# Altium project Candunio v2018july.PrjPcb
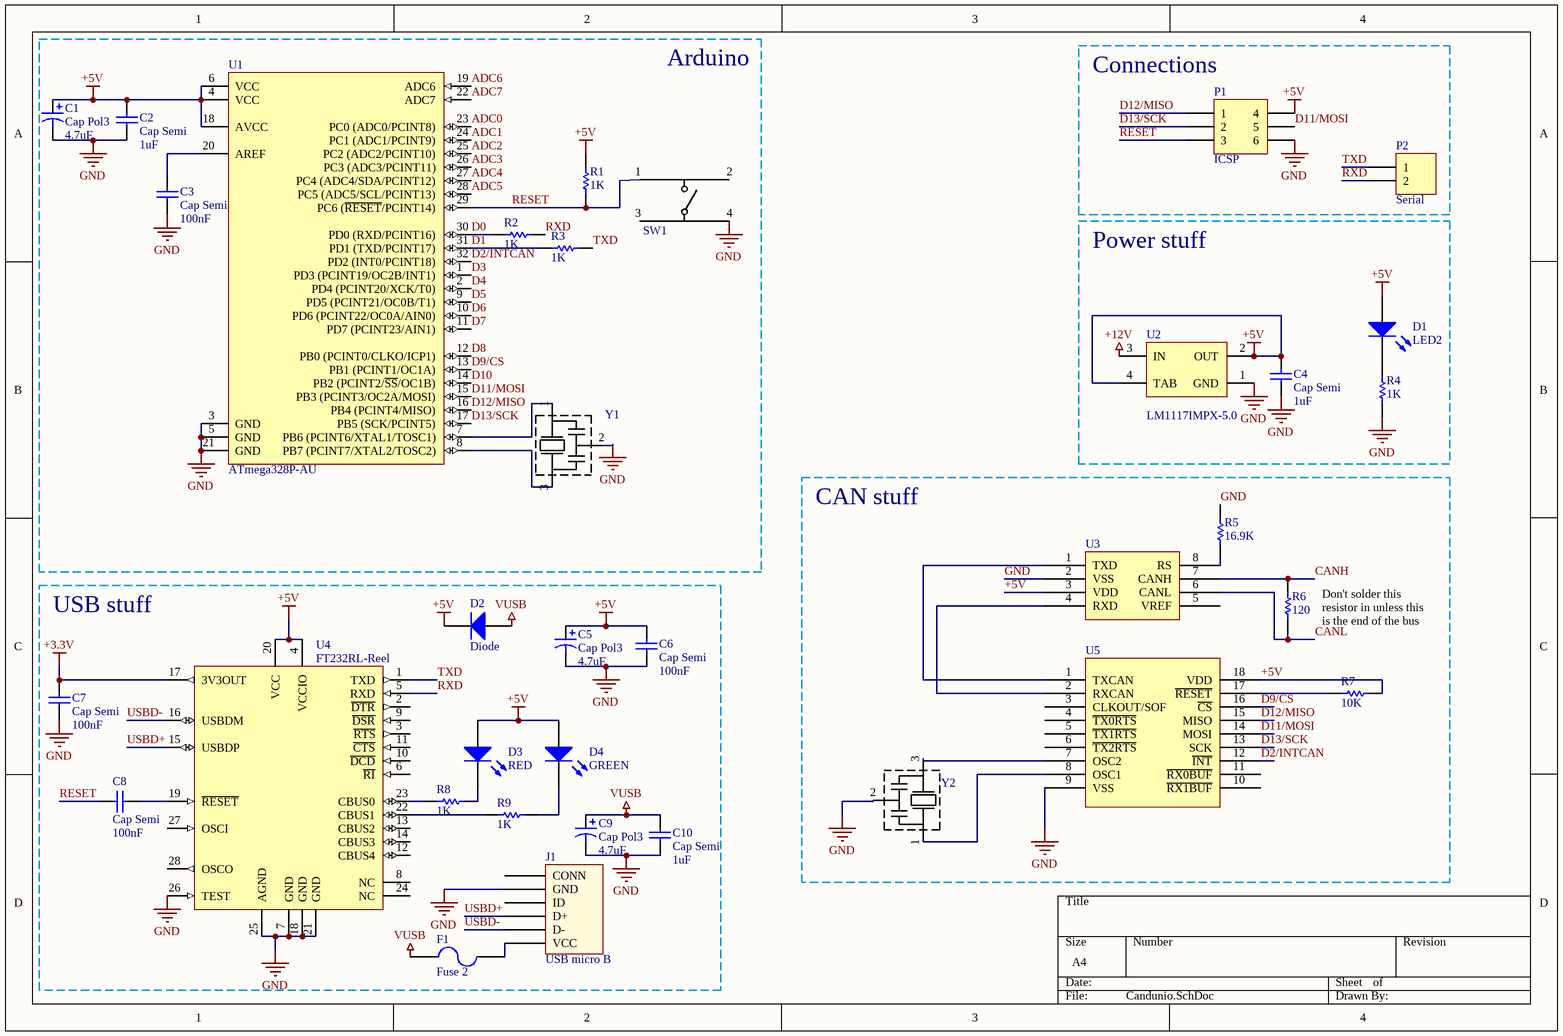
[diagram p0: Candunio.SchDoc]
1 sheet, 35 parts. Net scope: global (net labels, ports and power ports of the same name join across sheets).
Board file: Candunio.PcbDoc

## Sheet Candunio.SchDoc
size A4

### Parts
C1  Cap Pol3  value 4.7uF  [C1206]
C2  Cap Semi  value 1uF  [C1206]
C3  Cap Semi  value 100nF  [C1206]
C4  Cap Semi  value 1uF  [C1206]
C5  Cap Pol3  value 4.7uF  [C1206]
C6  Cap Semi  value 100nF  [C1206]
C7  Cap Semi  value 100nF  [C1206]
C8  Cap Semi  value 100nF  [C1206]
C9  Cap Pol3  value 4.7uF  [C1206]
C10  Cap Semi  value 1uF  [C1206]
D1  LED2  [3.2X1.6X1.1]
D2  Diode  [SMC]
D3  RED  [3.2X1.6X1.1]
D4  GREEN  [3.2X1.6X1.1]
F1  Fuse 2  [1812]
J1  USB micro B  [1050170001]
P1  ICSP  [HDR2X3_CEN]
P2  Serial  [HDR1X2]
R1  1K  [14-1210]
R2  1K  [14-1210]
R3  1K  [14-1210]
R4  1K  [14-1210]
R5  16.9K  [14-1210]
R6  120  [14-1210]
R7  10K  [14-1210]
R8  1K  [14-1210]
R9  1K  [14-1210]
SW1  PTS525SM15SMTR2  [PTS525SM15SMTR2]  (value not drawn)
U1  ATmega328P-AU  [32A_N]
U2  LM1117IMPX-5.0  [MP04A_N]
U3  MCP2551-E/SN  [SOIC127P600X175-8M]  (value not drawn)
U4  FT232RL-Reel  [SSOP-28_N]
U5  MCP2515-E/ST  [SOIC127P1030X265-18M]  (value not drawn)
Y1  CSTCE16M0V53-R0  [CSTCE16M0V53-R0]  (value not drawn)
Y2  CSTCE16M0V53-R0  [CSTCE16M0V53-R0]  (value not drawn)

### Blocks framed on the sheet
Arduino: C1-C3 R1-R3 SW1 U1 Y1
Connections: P1 P2
Power stuff: C4 D1 R4 U2
CAN stuff: R5-R7 U3 U5 Y2
USB stuff: C5-C10 D2-D4 F1 J1 R8 R9 U4

### Nets
+3.3V: C7.1 U4.17(3V3OUT)
+5V: C1.1 C2.1 C4.1 C5.1 C6.1 D1.1(A) D2.2(K) D3.1(A) D4.1(A) P1.4 R1.1 R7.2 U1.4(VCC) U1.6(VCC) U1.18(AVCC) U2.2(OUT) U2.4(TAB) U3.3(VDD) U4.4(VCCIO) U4.20(VCC) U5.18(VDD)
+12V: U2.3(IN)
GND: C1.2 C2.2 C3.2 C4.2 C5.2 C6.2 C7.2 C9.2 C10.2 J1.5(GND) P1.6 R4.2 R5.1 SW1.4 U1.3(GND) U1.5(GND) U1.21(GND) U2.1(GND) U3.2(VSS) U4.7(GND) U4.18(GND) U4.21(GND) U4.25(AGND) U4.26(TEST) U5.9(VSS) Y1.2 Y2.2
VUSB: C9.1 C10.1 D2.1(A) F1.1
ADC0: U1.23(PC0_(ADC0/PCINT8))
ADC1: U1.24(PC1_(ADC1/PCINT9))
ADC2: U1.25(PC2_(ADC2/PCINT10))
ADC3: U1.26(PC3_(ADC3/PCINT11))
ADC4: U1.27(PC4_(ADC4/SDA/PCINT12))
ADC5: U1.28(PC5_(ADC5/SCL/PCINT13))
ADC6: U1.19(ADC6)
ADC7: U1.22(ADC7)
CANH: R6.1 U3.7(CANH)
CANL: R6.2 U3.6(CANL)
D0: R2.1 U1.30(PD0_(RXD/PCINT16))
D1: R3.1 U1.31(PD1_(TXD/PCINT17))
D2/INTCAN: U1.32(PD2_(INT0/PCINT18)) U5.12(~{INT})
D3: U1.1(PD3_(PCINT19/OC2B/INT1))
D4: U1.2(PD4_(PCINT20/XCK/T0))
D5: U1.9(PD5_(PCINT21/OC0B/T1))
D6: U1.10(PD6_(PCINT22/OC0A/AIN0))
D7: U1.11(PD7_(PCINT23/AIN1))
D8: U1.12(PB0_(PCINT0/CLKO/ICP1))
D9/CS: U1.13(PB1_(PCINT1/OC1A)) U5.16(~{CS})
D10: U1.14(PB2_(PCINT2/~{SS}/OC1B))
D11/MOSI: P1.5 U1.15(PB3_(PCINT3/OC2A/MOSI)) U5.14(MOSI)
D12/MISO: P1.1 U1.16(PB4_(PCINT4/MISO)) U5.15(MISO)
D13/SCK: P1.2 U1.17(PB5_(SCK/PCINT5)) U5.13(SCK)
RESET: C8.1 P1.3 R1.2 SW1.1 U1.29(PC6_(~{RESET}/PCINT14))
RXD: P2.2 R2.2 U4.5(RXD)
TXD: P2.1 R3.2 U4.1(TXD)
USBD+: J1.3(D+) U4.15(USBDP)
USBD-: J1.2(D-) U4.16(USBDM)
NetC3_1: C3.1 U1.20(AREF)
NetC8_2: C8.2 U4.19(~{RESET})
NetD1_2: D1.2(K) R4.1
NetD3_2: D3.2(K) R8.2
NetD4_2: D4.2(K) R9.2
NetF1_2: F1.2 J1.1(VCC)
NetR5_2: R5.2 U3.8(RS)
NetR7_1: R7.1 U5.17(~{RESET})
NetR8_1: R8.1 U4.23(CBUS0)
NetR9_1: R9.1 U4.22(CBUS1)
NetU1_7: U1.7(PB6_(PCINT6/XTAL1/TOSC1)) Y1.1
NetU1_8: U1.8(PB7_(PCINT7/XTAL2/TOSC2)) Y1.3
NetU3_1: U3.1(TXD) U5.1(TXCAN)
NetU3_4: U3.4(RXD) U5.2(RXCAN)
NetU5_7: U5.7(OSC2) Y2.3
NetU5_8: U5.8(OSC1) Y2.1

Not connected (* = marked no-connect by the designer): J1 0(CONN) 4(ID); SW1 2 3; U3 5(VREF); U4 2(~{DTR}) 3(~{RTS}) 6(~{RI}) 8(NC) 9(~{DSR}) 10(~{DCD}) 11(~{CTS}) 12(CBUS4) 13(CBUS2) 14(CBUS3) 24(NC) 27(OSCI) 28(OSCO); U5 3(CLKOUT/SOF) 4(~{TX0RTS}) 5(~{TX1RTS}) 6(~{TX2RTS}) 10(~{RX1BUF}) 11(~{RX0BUF})

### Notes on the sheet
- (near R6) Don't solder this resistor in unless this is the end of the bus

### Library data of the parts
C1 C5 C9 = Cap Pol3: Polarized Capacitor (Surface Mount); Published: 8-Jun-2000; LatestRevisionDate: 29-May-2009; LatestRevisionNote: IPC-7351 Footprint Added.; PackageReference: C0805; Publisher: Altium Limited; PackageDescription: Chip Capacitor
C2-C4 C6-C8 C10 = Cap Semi: Capacitor (Semiconductor SIM Model); Published: 8-Jun-2000; LatestRevisionDate: 29-May-2009; LatestRevisionNote: IPC-7351 Footprint Added.; PackageReference: C1206; Publisher: Altium Limited; PackageDescription: Chip Capacitor
D1 D3 D4 = LED2: Typical RED, GREEN, YELLOW, AMBER GaAs LED; Published: 8-Jun-2000; LatestRevisionDate: 17-Jul-2002; LatestRevisionNote: Re-released for DXP Platform.; PackageVersion: Feb-2002; PackageReference: 3.2X1.6X1.1; Publisher: Altium Limited; PackageDescription: SM LED; 2 Flat Leads
  D1 D4: Supplier Part Number: 160-1456-1-ND
  D3: Supplier Part Number: 160-1457-1-ND
D2 = Diode: Default Diode; Published: 8-Jun-2000; LatestRevisionDate: 17-Jul-2002; LatestRevisionNote: Re-released for DXP Platform.; PackageVersion: Sep-1996; PackageReference: SMC; Publisher: Altium Limited; PackageDescription: DO-214-AB/SMC; 2 C-Bend Leads; Body 7.9 x 5.9 mm, inc. leads (LxW); Code_JEDEC: DO-214-AB
F1 = Fuse 2: Fuse; part number: MF-MSMF050-2; Published: 8-Jun-2000; LatestRevisionDate: 17-Jul-2002; LatestRevisionNote: Re-released for DXP Platform.; PackageReference: PIN-W2/E2.8; Publisher: Altium Limited; PackageDescription: Thru-Hole; 2 Leads
J1 = 1050170001: CONN SM TH USB MICRO MODIFIED FOR DRILL; Part number: WM1399CT-ND; Details: Modified from reference footprint for standard drill hits (rather than slots)
P1 = Header 3X2A: Header, 3-Pin, Dual row; LatestRevisionDate: 17-Jul-2002; LatestRevisionNote: Re-released for DXP Platform.; Publisher: Altium Limited
P2 = Header 2: Header, 2-Pin; LatestRevisionDate: 17-Jul-2002; LatestRevisionNote: Re-released for DXP Platform.; Publisher: Altium Limited
R1-R9 = Res1: Resistor; Supplier Part Number: 311-1.0KGRCT-ND
  R1-R4 R8 R9: Value: 1K
  R5: Value: 16.9K
  R6: Value: 120
  R7: Value: 10K
U1 = ATmega328P-AU: 8-bit AVR Microcontroller, 32KB Flash, 1KB EEPROM, 2KB SRAM, 32-pin TQFP, Industrial Grade (-40°C to 85°C); Published: 1-Apr-2010; DatasheetVersion: revA, Jan-2010; PackageVersion: revB, Oct-2001; PackageReference: 32A; Publisher: Altium Limited; PackageDescription: 32-Lead, 7x7x1.0 mm Body, 0.8mm Lead Pitch, Thin Profile Plastic Quad Flat Package (TQFP); Supplier 1: Digi-Key; Supplier Part Number 1: ATMEGA328P-AU-ND; Supplier 2: Farnell; Supplier Part Number 2: 1715486; Supplier 3: Mouser; Supplier Part Number 3: 556-ATMEGA328P-AU; Code_JEDEC: MS-026-ABA; ComponentLink1Description: Manufacturer Link; ComponentLink1URL: http://www.atmel.com/products/avr/default.asp?; ComponentLink2Description: ATmega48A/48PA/88A/88PA/168A/168PA/328/328P Datasheet; ComponentLink2URL: http://www.atmel.com/dyn/resources/prod_documents/8271.pdf; ComponentLink3Description: ATmega48A/48PA/88A/88PA/168A/168PA/328/328P Summary; ComponentLink3URL: http://www.atmel.com/dyn/resources/prod_documents/8271S.pdf; ComponentLink4Description: Atmel.com Home; ComponentLink4URL: http://www.atmel.com
U2 = LM1117IMPX-5.0: 800mA Low-Dropout Linear Regulator, 4-pin SOT-223; Manufacturer: National Semiconductor; PackageTopMarking: XYTT*N06B; PowerWise: N; CompType: LDO IC; Published: 1-Mar-2010; DatasheetVersion: Apr-2006; PackageVersion: revB, Apr-2003; PackageReference: MP04A; Publisher: Altium Limited; PackageDescription: Molded SOT-223, 6.50 x 3.56 x 1.6mm Body, 4 Lead, 2.3mm Pitch; PartNumber: LM1117IMPX-5.0; RoHS: N; PinCount: 4; Code_JEDEC: TO-261-AA; Code_IPC: SOT223-4; ComponentLink1Description: LM1117 Datasheet; ComponentLink1URL: http://www.national.com/ds/LM/LM1117.pdf; ComponentLink2Description: LM1117 Web Page; ComponentLink2URL: http://www.national.com/pf/LM/LM1117.html; ComponentLink3Description: MP04A Package Page; ComponentLink3URL: http://www.national.com/packaging/folders/mp04a.html
U3 = MCP2551-E/SN: SOIC; Supplier Part Number: MCP2551-E/SN-ND
U4 = FT232RL-Reel: USB UART Asynchronous Serial Data Transfer Chip, SSOP-28, Tape and Reel; Published: 19-Aug-2010; DatasheetVersion: ver 2.07, Jul-2010; PackageVersion: 2010; PackageReference: SSOP-28; Publisher: Altium Limited; PackageDescription: 28-Pin Small Outline Package 0.65 mm Pitch; ComponentLink1Description: Manufacturer Link; ComponentLink1URL: http://www.ftdichip.com/Products/ICs/FT232R.htm; ComponentLink2Description: Datasheet; ComponentLink2URL: http://www.ftdichip.com/Support/Documents/DataSheets/ICs/DS_FT232R.pdf
U5 = MCP2515-E/ST: SOIC; Supplier Part Number: MCP2515-I/SO-ND
SW1 = PTS525SM15SMTR2: Supplier 1: Digi-Key; Supplier Part Number: CKN9104CT-ND
Y1 Y2 = CSTCE16M0V53-R0: Supplier Part Number: 490-1198-1-ND